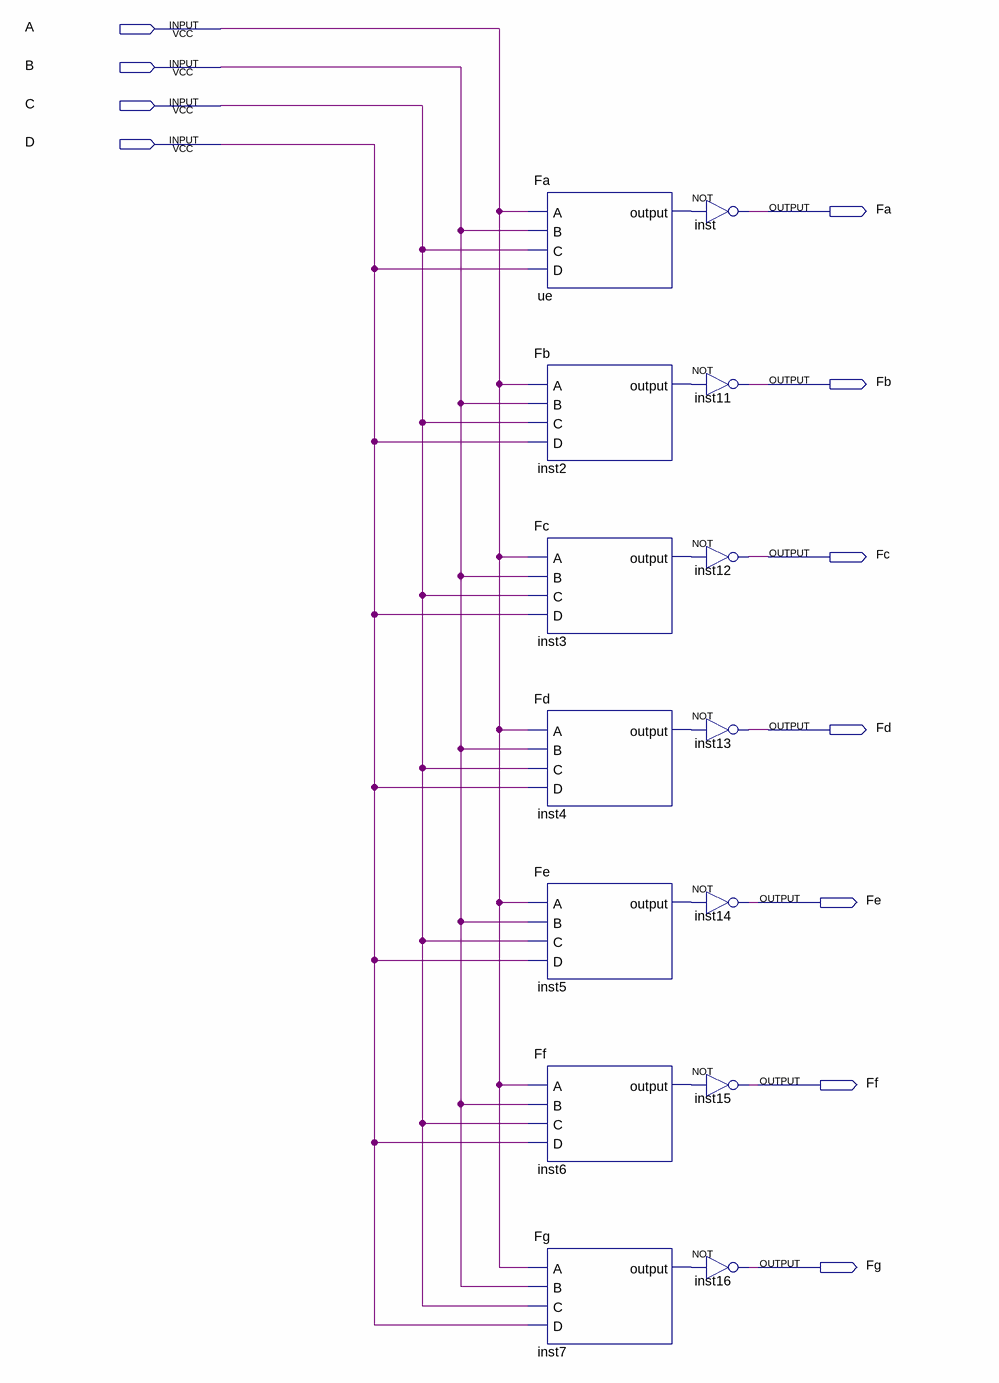
[diagram p0: schematic sheet]
// Quartus schematic Hex7Seg.bdf as structural Verilog: 14 symbols, 11 pins
module Hex7Seg (
  input  A,
  input  B,
  input  C,
  input  D,
  output Fa,
  output Fb,
  output Fc,
  output Fd,
  output Fe,
  output Ff,
  output Fg
);

  wire inst2_output, inst3_output, inst4_output, inst5_output, inst6_output, inst7_output, ue_output;

  Fa ue (.A(A), .B(B), .C(C), .D(D), .\output (ue_output));
  Fb inst2 (.A(A), .B(B), .C(C), .D(D), .\output (inst2_output));
  Fc inst3 (.A(A), .B(B), .C(C), .D(D), .\output (inst3_output));
  Fd inst4 (.A(A), .B(B), .C(C), .D(D), .\output (inst4_output));
  Fe inst5 (.A(A), .B(B), .C(C), .D(D), .\output (inst5_output));
  Ff inst6 (.A(A), .B(B), .C(C), .D(D), .\output (inst6_output));
  Fg inst7 (.A(A), .B(B), .C(C), .D(D), .\output (inst7_output));
  not inst (Fa, ue_output);
  not inst11 (Fb, inst2_output);
  not inst12 (Fc, inst3_output);
  not inst13 (Fd, inst4_output);
  not inst14 (Fe, inst5_output);
  not inst15 (Ff, inst6_output);
  not inst16 (Fg, inst7_output);
endmodule
